# Altium schematic sheet [13] - SFP+ MODULES.SchDoc
size A2; DocumentNumber: 13; SheetNumber: 13; SheetTotal: 15
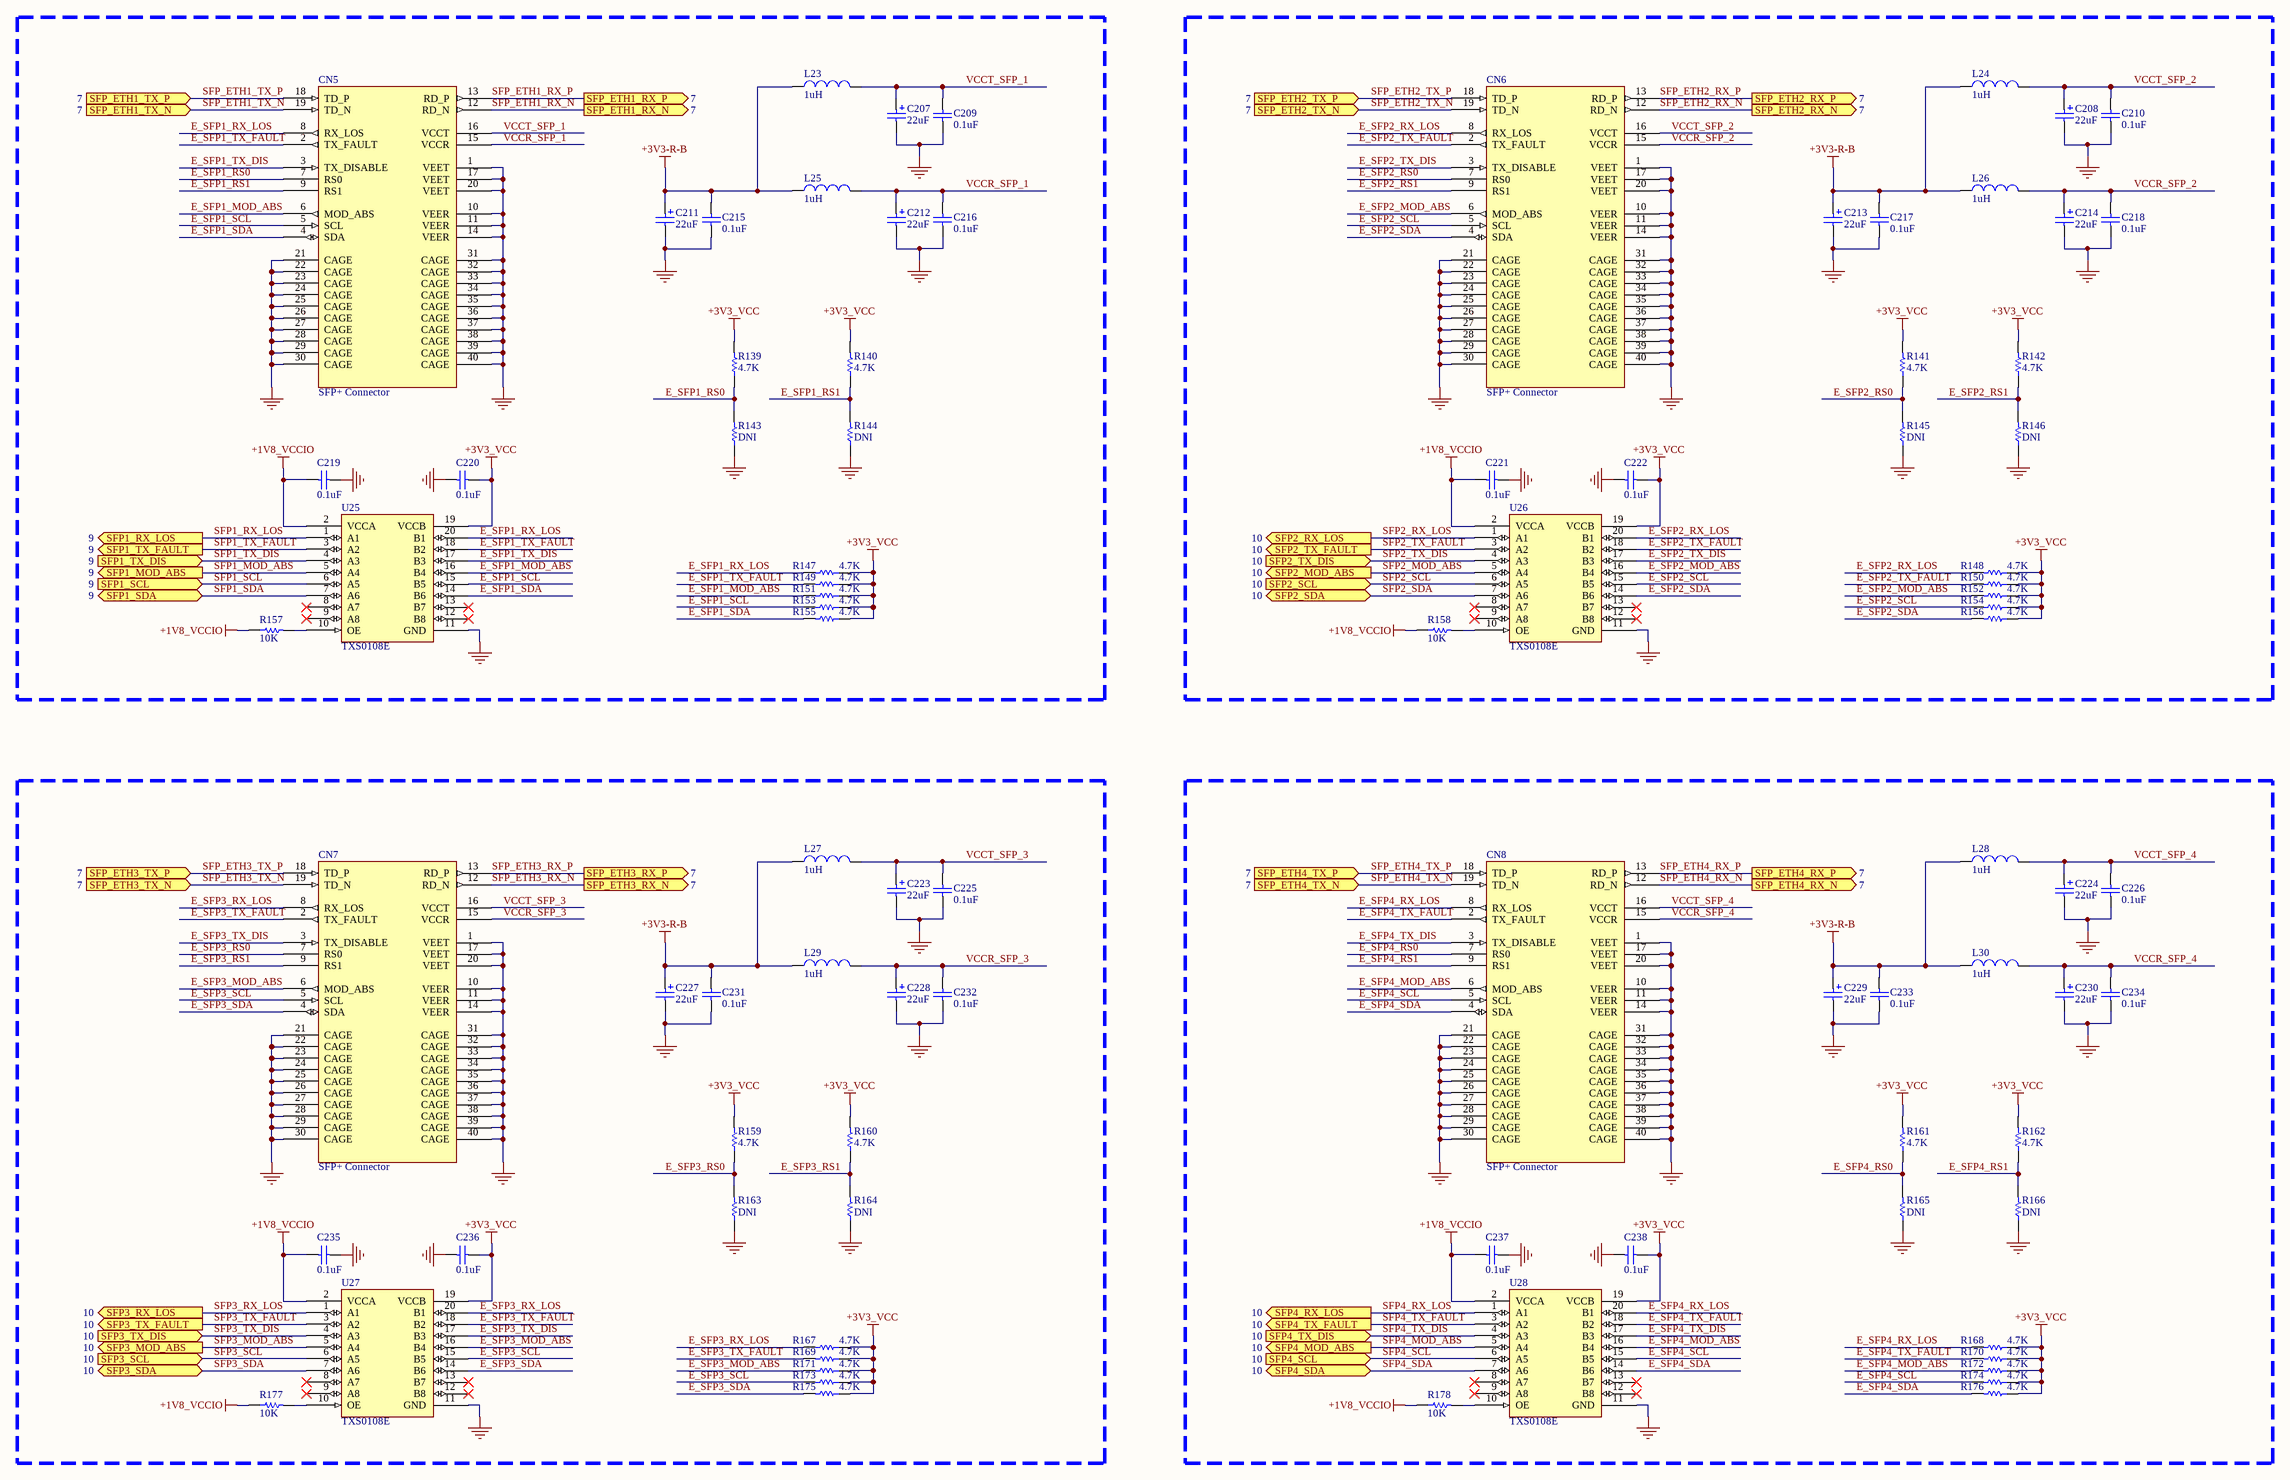
[diagram p0: [13] - SFP+ MODULES.SchDoc]

## Parts
C207  22uF  [WCAP-ASLL_8x10.5]
C208  22uF  [WCAP-ASLL_8x10.5]
C209  0.1uF  [0402_C]
C210  0.1uF  [0402_C]
C211  22uF  [WCAP-ASLL_8x10.5]
C212  22uF  [WCAP-ASLL_8x10.5]
C213  22uF  [WCAP-ASLL_8x10.5]
C214  22uF  [WCAP-ASLL_8x10.5]
C215  0.1uF  [0402_C]
C216  0.1uF  [0402_C]
C217  0.1uF  [0402_C]
C218  0.1uF  [0402_C]
C219  0.1uF  [0402_C]
C220  0.1uF  [0402_C]
C221  0.1uF  [0402_C]
C222  0.1uF  [0402_C]
C223  22uF  [WCAP-ASLL_8x10.5]
C224  22uF  [WCAP-ASLL_8x10.5]
C225  0.1uF  [0402_C]
C226  0.1uF  [0402_C]
C227  22uF  [WCAP-ASLL_8x10.5]
C228  22uF  [WCAP-ASLL_8x10.5]
C229  22uF  [WCAP-ASLL_8x10.5]
C230  22uF  [WCAP-ASLL_8x10.5]
C231  0.1uF  [0402_C]
C232  0.1uF  [0402_C]
C233  0.1uF  [0402_C]
C234  0.1uF  [0402_C]
C235  0.1uF  [0402_C]
C236  0.1uF  [0402_C]
C237  0.1uF  [0402_C]
C238  0.1uF  [0402_C]
CN5  SFP+ Connector
CN6  SFP+ Connector
CN7  SFP+ Connector
CN8  SFP+ Connector
L23  1uH  [0402_R]
L24  1uH  [0402_R]
L25  1uH  [0402_R]
L26  1uH  [0402_R]
L27  1uH  [0402_R]
L28  1uH  [0402_R]
L29  1uH  [0402_R]
L30  1uH  [0402_R]
R139  4.7K  [0805_R]
R140  4.7K  [0805_R]
R141  4.7K  [0805_R]
R142  4.7K  [0805_R]
R143  DNI  [0805_R]
R144  DNI  [0805_R]
R145  DNI  [0805_R]
R146  DNI  [0805_R]
R147  4.7K  [0805_R]
R148  4.7K  [0805_R]
R149  4.7K  [0805_R]
R150  4.7K  [0805_R]
R151  4.7K  [0805_R]
R152  4.7K  [0805_R]
R153  4.7K  [0805_R]
R154  4.7K  [0805_R]
R155  4.7K  [0805_R]
R156  4.7K  [0805_R]
R157  10K  [0402_R]
R158  10K  [0402_R]
R159  4.7K  [0805_R]
R160  4.7K  [0805_R]
R161  4.7K  [0805_R]
R162  4.7K  [0805_R]
R163  DNI  [0805_R]
R164  DNI  [0805_R]
R165  DNI  [0805_R]
R166  DNI  [0805_R]
R167  4.7K  [0805_R]
R168  4.7K  [0805_R]
R169  4.7K  [0805_R]
R170  4.7K  [0805_R]
R171  4.7K  [0805_R]
R172  4.7K  [0805_R]
R173  4.7K  [0805_R]
R174  4.7K  [0805_R]
R175  4.7K  [0805_R]
R176  4.7K  [0805_R]
R177  10K  [0402_R]
R178  10K  [0402_R]
U25  TXS0108E
U26  TXS0108E
U27  TXS0108E
U28  TXS0108E

## Ports
SFP1_MOD_ABS (out, see 9), SFP1_RX_LOS (out, see 9), SFP1_SCL (in, see 9), SFP1_SDA (bidir, see 9), SFP1_TX_DIS (in, see 9), SFP1_TX_FAULT (out, see 9), SFP2_MOD_ABS (out, see 10), SFP2_RX_LOS (out, see 10), SFP2_SCL (in, see 10), SFP2_SDA (bidir, see 10), SFP2_TX_DIS (in, see 10), SFP2_TX_FAULT (out, see 10), SFP3_MOD_ABS (out, see 10), SFP3_RX_LOS (out, see 10), SFP3_SCL (in, see 10), SFP3_SDA (bidir, see 10), SFP3_TX_DIS (in, see 10), SFP3_TX_FAULT (out, see 10), SFP4_MOD_ABS (out, see 10), SFP4_RX_LOS (out, see 10), SFP4_SCL (in, see 10), SFP4_SDA (bidir, see 10), SFP4_TX_DIS (in, see 10), SFP4_TX_FAULT (out, see 10), SFP_ETH1_RX_N (out, see 7), SFP_ETH1_RX_P (out, see 7), SFP_ETH1_TX_N (in, see 7), SFP_ETH1_TX_P (in, see 7), SFP_ETH2_RX_N (out, see 7), SFP_ETH2_RX_P (out, see 7), SFP_ETH2_TX_N (in, see 7), SFP_ETH2_TX_P (in, see 7), SFP_ETH3_RX_N (out, see 7), SFP_ETH3_RX_P (out, see 7), SFP_ETH3_TX_N (in, see 7), SFP_ETH3_TX_P (in, see 7), SFP_ETH4_RX_N (out, see 7), SFP_ETH4_RX_P (out, see 7), SFP_ETH4_TX_N (in, see 7), SFP_ETH4_TX_P (in, see 7)

## Nets
+1V8_VCCIO: C219.2 C221.2 C235.2 C237.2 R157.1 R158.1 R177.1 R178.1 U25.2(VCCA) U26.2(VCCA) U27.2(VCCA) U28.2(VCCA)
+3V3-R-B: C211.1 C213.1 C215.1 C217.1 C227.1 C229.1 C231.1 C233.1 L23.1 L24.1 L25.1 L26.1 L27.1 L28.1 L29.1 L30.1
+3V3_VCC: C220.1 C222.1 C236.1 C238.1 R139.2 R140.2 R141.2 R142.2 R147.1 R148.1 R149.1 R150.1 R151.1 R152.1 R153.1 R154.1 R155.1 R156.1 R159.2 R160.2 R161.2 R162.2 R167.1 R168.1 R169.1 R170.1 R171.1 R172.1 R173.1 R174.1 R175.1 R176.1 U25.19(VCCB) U26.19(VCCB) U27.19(VCCB) U28.19(VCCB)
GND: C207.2 C208.2 C209.2 C210.2 C211.2 C212.2 C213.2 C214.2 C215.2 C216.2 C217.2 C218.2 C219.1 C220.2 C221.1 C222.2 C223.2 C224.2 C225.2 C226.2 C227.2 C228.2 C229.2 C230.2 C231.2 C232.2 C233.2 C234.2 C235.1 C236.2 C237.1 C238.2 CN5.1(VEET) CN5.10(VEER) CN5.11(VEER) CN5.14(VEER) CN5.17(VEET) CN5.20(VEET) CN5.21(CAGE) CN5.22(CAGE) CN5.23(CAGE) CN5.24(CAGE) CN5.25(CAGE) CN5.26(CAGE) CN5.27(CAGE) CN5.28(CAGE) CN5.29(CAGE) CN5.30(CAGE) CN5.31(CAGE) CN5.32(CAGE) CN5.33(CAGE) CN5.34(CAGE) CN5.35(CAGE) CN5.36(CAGE) CN5.37(CAGE) CN5.38(CAGE) CN5.39(CAGE) CN5.40(CAGE) CN6.1(VEET) CN6.10(VEER) CN6.11(VEER) CN6.14(VEER) CN6.17(VEET) CN6.20(VEET) CN6.21(CAGE) CN6.22(CAGE) CN6.23(CAGE) CN6.24(CAGE) CN6.25(CAGE) CN6.26(CAGE) CN6.27(CAGE) CN6.28(CAGE) CN6.29(CAGE) CN6.30(CAGE) CN6.31(CAGE) CN6.32(CAGE) CN6.33(CAGE) CN6.34(CAGE) CN6.35(CAGE) CN6.36(CAGE) CN6.37(CAGE) CN6.38(CAGE) CN6.39(CAGE) CN6.40(CAGE) CN7.1(VEET) CN7.10(VEER) CN7.11(VEER) CN7.14(VEER) CN7.17(VEET) CN7.20(VEET) CN7.21(CAGE) CN7.22(CAGE) CN7.23(CAGE) CN7.24(CAGE) CN7.25(CAGE) CN7.26(CAGE) CN7.27(CAGE) CN7.28(CAGE) CN7.29(CAGE) CN7.30(CAGE) CN7.31(CAGE) CN7.32(CAGE) CN7.33(CAGE) CN7.34(CAGE) CN7.35(CAGE) CN7.36(CAGE) CN7.37(CAGE) CN7.38(CAGE) CN7.39(CAGE) CN7.40(CAGE) CN8.1(VEET) CN8.10(VEER) CN8.11(VEER) CN8.14(VEER) CN8.17(VEET) CN8.20(VEET) CN8.21(CAGE) CN8.22(CAGE) CN8.23(CAGE) CN8.24(CAGE) CN8.25(CAGE) CN8.26(CAGE) CN8.27(CAGE) CN8.28(CAGE) CN8.29(CAGE) CN8.30(CAGE) CN8.31(CAGE) CN8.32(CAGE) CN8.33(CAGE) CN8.34(CAGE) CN8.35(CAGE) CN8.36(CAGE) CN8.37(CAGE) CN8.38(CAGE) CN8.39(CAGE) CN8.40(CAGE) R143.1 R144.1 R145.1 R146.1 R163.1 R164.1 R165.1 R166.1 U25.11(GND) U26.11(GND) U27.11(GND) U28.11(GND)
E_SFP1_MOD_ABS: CN5.6(MOD_ABS) R151.2 U25.16(B4)
E_SFP1_RS0: CN5.7(RS0) R139.1 R143.2
E_SFP1_RS1: CN5.9(RS1) R140.1 R144.2
E_SFP1_RX_LOS: CN5.8(RX_LOS) R147.2 U25.20(B1)
E_SFP1_SCL: CN5.5(SCL) R153.2 U25.15(B5)
E_SFP1_SDA: CN5.4(SDA) R155.2 U25.14(B6)
E_SFP1_TX_DIS: CN5.3(TX_DISABLE) U25.17(B3)
E_SFP1_TX_FAULT: CN5.2(TX_FAULT) R149.2 U25.18(B2)
E_SFP2_MOD_ABS: CN6.6(MOD_ABS) R152.2 U26.16(B4)
E_SFP2_RS0: CN6.7(RS0) R141.1 R145.2
E_SFP2_RS1: CN6.9(RS1) R142.1 R146.2
E_SFP2_RX_LOS: CN6.8(RX_LOS) R148.2 U26.20(B1)
E_SFP2_SCL: CN6.5(SCL) R154.2 U26.15(B5)
E_SFP2_SDA: CN6.4(SDA) R156.2 U26.14(B6)
E_SFP2_TX_DIS: CN6.3(TX_DISABLE) U26.17(B3)
E_SFP2_TX_FAULT: CN6.2(TX_FAULT) R150.2 U26.18(B2)
E_SFP3_MOD_ABS: CN7.6(MOD_ABS) R171.2 U27.16(B4)
E_SFP3_RS0: CN7.7(RS0) R159.1 R163.2
E_SFP3_RS1: CN7.9(RS1) R160.1 R164.2
E_SFP3_RX_LOS: CN7.8(RX_LOS) R167.2 U27.20(B1)
E_SFP3_SCL: CN7.5(SCL) R173.2 U27.15(B5)
E_SFP3_SDA: CN7.4(SDA) R175.2 U27.14(B6)
E_SFP3_TX_DIS: CN7.3(TX_DISABLE) U27.17(B3)
E_SFP3_TX_FAULT: CN7.2(TX_FAULT) R169.2 U27.18(B2)
E_SFP4_MOD_ABS: CN8.6(MOD_ABS) R172.2 U28.16(B4)
E_SFP4_RS0: CN8.7(RS0) R161.1 R165.2
E_SFP4_RS1: CN8.9(RS1) R162.1 R166.2
E_SFP4_RX_LOS: CN8.8(RX_LOS) R168.2 U28.20(B1)
E_SFP4_SCL: CN8.5(SCL) R174.2 U28.15(B5)
E_SFP4_SDA: CN8.4(SDA) R176.2 U28.14(B6)
E_SFP4_TX_DIS: CN8.3(TX_DISABLE) U28.17(B3)
E_SFP4_TX_FAULT: CN8.2(TX_FAULT) R170.2 U28.18(B2)
SFP1_MOD_ABS: U25.5(A4) ; port SFP1_MOD_ABS
SFP1_RX_LOS: U25.1(A1) ; port SFP1_RX_LOS
SFP1_SCL: U25.6(A5) ; port SFP1_SCL
SFP1_SDA: U25.7(A6) ; port SFP1_SDA
SFP1_TX_DIS: U25.4(A3) ; port SFP1_TX_DIS
SFP1_TX_FAULT: U25.3(A2) ; port SFP1_TX_FAULT
SFP2_MOD_ABS: U26.5(A4) ; port SFP2_MOD_ABS
SFP2_RX_LOS: U26.1(A1) ; port SFP2_RX_LOS
SFP2_SCL: U26.6(A5) ; port SFP2_SCL
SFP2_SDA: U26.7(A6) ; port SFP2_SDA
SFP2_TX_DIS: U26.4(A3) ; port SFP2_TX_DIS
SFP2_TX_FAULT: U26.3(A2) ; port SFP2_TX_FAULT
SFP3_MOD_ABS: U27.5(A4) ; port SFP3_MOD_ABS
SFP3_RX_LOS: U27.1(A1) ; port SFP3_RX_LOS
SFP3_SCL: U27.6(A5) ; port SFP3_SCL
SFP3_SDA: U27.7(A6) ; port SFP3_SDA
SFP3_TX_DIS: U27.4(A3) ; port SFP3_TX_DIS
SFP3_TX_FAULT: U27.3(A2) ; port SFP3_TX_FAULT
SFP4_MOD_ABS: U28.5(A4) ; port SFP4_MOD_ABS
SFP4_RX_LOS: U28.1(A1) ; port SFP4_RX_LOS
SFP4_SCL: U28.6(A5) ; port SFP4_SCL
SFP4_SDA: U28.7(A6) ; port SFP4_SDA
SFP4_TX_DIS: U28.4(A3) ; port SFP4_TX_DIS
SFP4_TX_FAULT: U28.3(A2) ; port SFP4_TX_FAULT
SFP_ETH1_RX_N: CN5.12(RD_N) ; port SFP_ETH1_RX_N
SFP_ETH1_RX_P: CN5.13(RD_P) ; port SFP_ETH1_RX_P
SFP_ETH1_TX_N: CN5.19(TD_N) ; port SFP_ETH1_TX_N
SFP_ETH1_TX_P: CN5.18(TD_P) ; port SFP_ETH1_TX_P
SFP_ETH2_RX_N: CN6.12(RD_N) ; port SFP_ETH2_RX_N
SFP_ETH2_RX_P: CN6.13(RD_P) ; port SFP_ETH2_RX_P
SFP_ETH2_TX_N: CN6.19(TD_N) ; port SFP_ETH2_TX_N
SFP_ETH2_TX_P: CN6.18(TD_P) ; port SFP_ETH2_TX_P
SFP_ETH3_RX_N: CN7.12(RD_N) ; port SFP_ETH3_RX_N
SFP_ETH3_RX_P: CN7.13(RD_P) ; port SFP_ETH3_RX_P
SFP_ETH3_TX_N: CN7.19(TD_N) ; port SFP_ETH3_TX_N
SFP_ETH3_TX_P: CN7.18(TD_P) ; port SFP_ETH3_TX_P
SFP_ETH4_RX_N: CN8.12(RD_N) ; port SFP_ETH4_RX_N
SFP_ETH4_RX_P: CN8.13(RD_P) ; port SFP_ETH4_RX_P
SFP_ETH4_TX_N: CN8.19(TD_N) ; port SFP_ETH4_TX_N
SFP_ETH4_TX_P: CN8.18(TD_P) ; port SFP_ETH4_TX_P
VCCR_SFP_1: C212.1 C216.1 CN5.15(VCCR) L25.2
VCCR_SFP_2: C214.1 C218.1 CN6.15(VCCR) L26.2
VCCR_SFP_3: C228.1 C232.1 CN7.15(VCCR) L29.2
VCCR_SFP_4: C230.1 C234.1 CN8.15(VCCR) L30.2
VCCT_SFP_1: C207.1 C209.1 CN5.16(VCCT) L23.2
VCCT_SFP_2: C208.1 C210.1 CN6.16(VCCT) L24.2
VCCT_SFP_3: C223.1 C225.1 CN7.16(VCCT) L27.2
VCCT_SFP_4: C224.1 C226.1 CN8.16(VCCT) L28.2
NetR157_2: R157.2 U25.10(OE)
NetR158_2: R158.2 U26.10(OE)
NetR177_2: R177.2 U27.10(OE)
NetR178_2: R178.2 U28.10(OE)

Not connected (* = marked no-connect by the designer): U25 8(A7)* 9(A8)* 12(B8)* 13(B7)*; U26 8(A7)* 9(A8)* 12(B8)* 13(B7)*; U27 8(A7)* 9(A8)* 12(B8)* 13(B7)*; U28 8(A7)* 9(A8)* 12(B8)* 13(B7)*

## Library data of the parts
C207 C208 C211-C214 C223 C224 C227-C230 = Cap Aluminium Electrolytic: Aluminium Electrolytic Capacitor; RATED_VOLTAGE: 50V; Value: 22uF; Manufacturer Part Num: *
C209 C210 C215-C222 C225 C226 C231-C238 = Cap SMD: Non-Pol SMD Capacitor; RATED_VOLTAGE: 16V; Value: 0.1uF; Manufacturer Part Num: *; Dielectric: *
CN5-CN8 = SFP+ Connector: SFP+ Host Connector, Z-Axis Pluggable, Right-Angle, Surface Mount, 20 Circuits , and EMI Cage; Value: SFP+ Connector; Manufacturer Part Num: *
L23-L30 = Inductor: Inductor SMD; Value: 1uH; Manufacturer Part Num: *
R139-R178 = Res SMD: SMD Resistor; Tolerance: 5%; Manufacturer Part Num: *
  R139-R142 R147-R156 R159-R162 R167-R176: Value: 4.7K
  R143-R146 R163-R166: Value: DNI
  R157 R158 R177 R178: Value: 10K
U25-U28 = TXS0108E: 8-Bit Bidirectional Voltage-Level Translator for Open-Drain and Push-Pull Applications; Manufacturer Part Num: TXS0108EPWR; Value: TXS0108E